# EAGLE design logic (EAGLE 7.1.0)
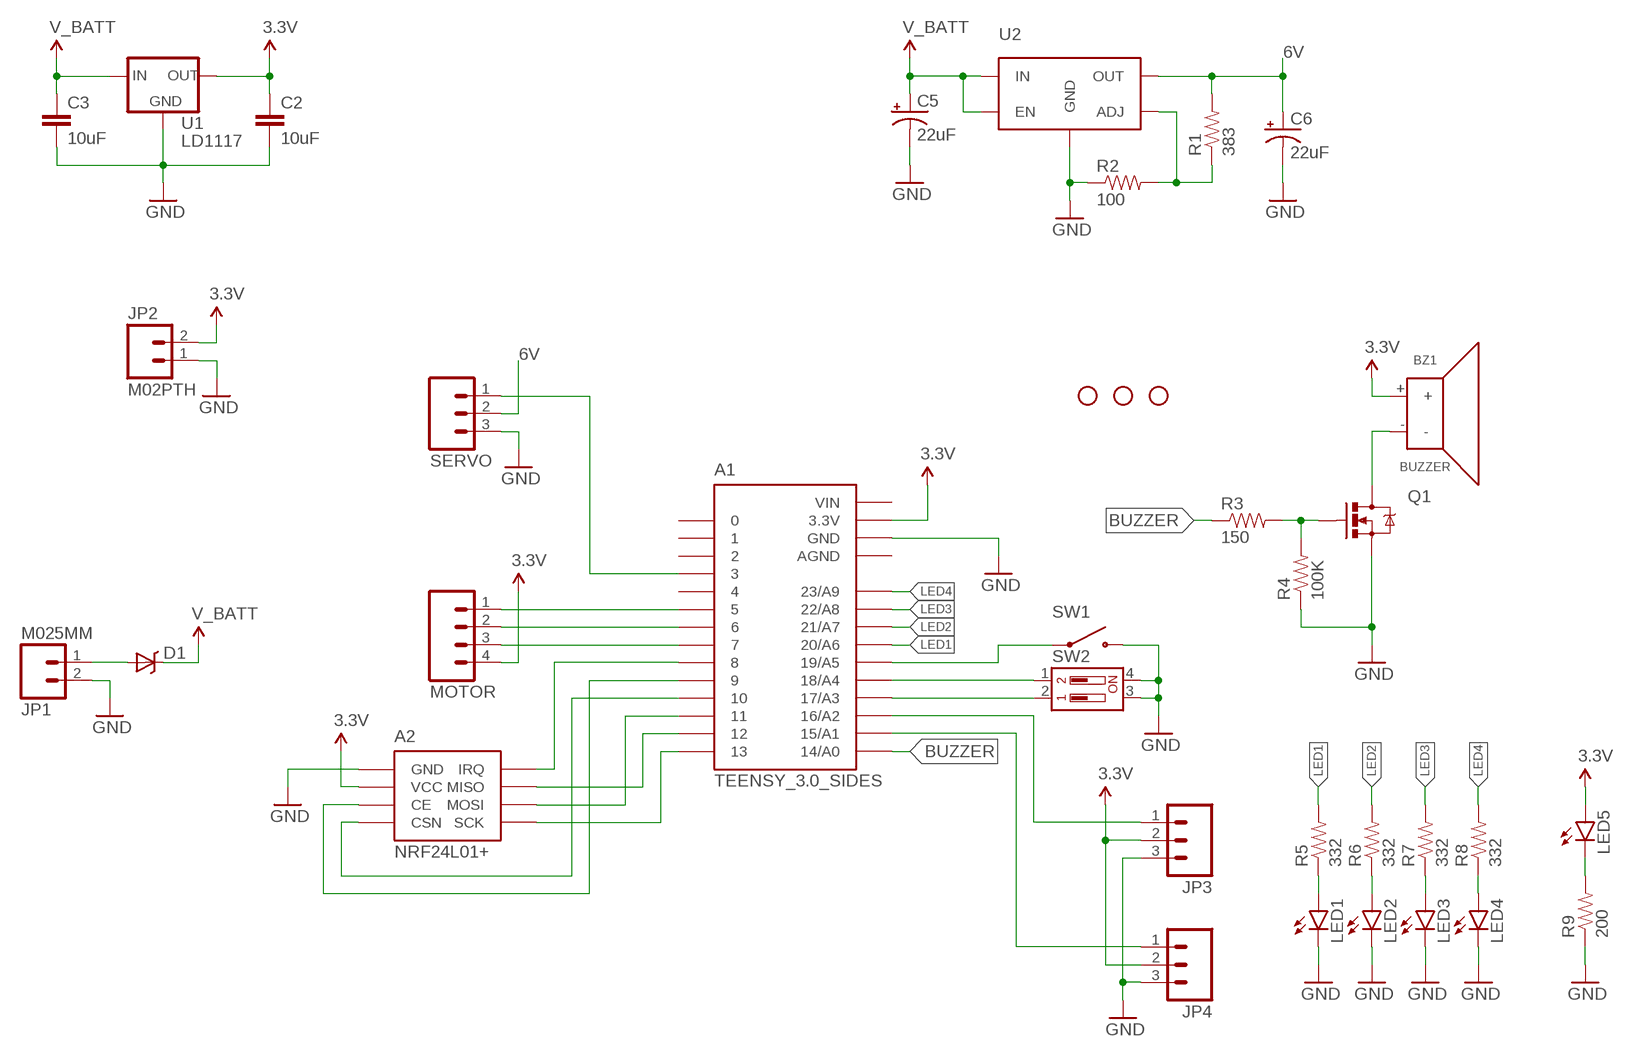
[diagram p0: schematic, sheet 1]

## Parts
A1  TEENSY_3.0_SIDES  [TEENSY_3.0_SIDES]
A2  NRF24L01+  [NRF24L01+]
BZ1  BUZZER  [BUZZER]
C2  10uF  CAP1206  [1206]
C3  10uF  CAP1206  [1206]
C5  22uF  CAP_POLPTH2  [CPOL-RADIAL-10UF-25V]
C6  22uF  CAP_POLPTH2  [CPOL-RADIAL-10UF-25V]
D1  DIODE-SCHOTTKY_  [SMA-DIODE]
JP1  M025MM  [SCREWTERMINAL-5MM-2]
JP2  M02PTH  [1X02]
JP3  M03LOCK  [1X03_LOCK]
JP4  M03LOCK  [1X03_LOCK]
LED1  LED0603  [LED-0603]
LED2  LED0603  [LED-0603]
LED3  LED0603  [LED-0603]
LED4  LED0603  [LED-0603]
LED5  LED0603  [LED-0603]
MOTOR  M04LOCK  [1X04_LOCK]
Q1  MOSFET-NCHANNELBSS123LT1G  [SOT23-3]
R1  383  RESISTOR0603-RES  [0603-RES]
R2  100  RESISTOR0603-RES  [0603-RES]
R3  150  RESISTOR0603-RES  [0603-RES]
R4  100K  RESISTOR0603-RES  [0603-RES]
R5  332  RESISTOR0603-RES  [0603-RES]
R6  332  RESISTOR0603-RES  [0603-RES]
R7  332  RESISTOR0603-RES  [0603-RES]
R8  332  RESISTOR0603-RES  [0603-RES]
R9  200  RESISTOR0603-RES  [0603-RES]
SERVO  M03LOCK_LONGPADS  [1X03_LOCK_LONGPADS]
STANDOFF1  STAND-OFF  [STAND-OFF]
STANDOFF2  STAND-OFF  [STAND-OFF]
STANDOFF3  STAND-OFF  [STAND-OFF]
SW1  FSM4JSMA  [FSM4JSMA]
SW2  2-POS-DIPCTS-THRU-HOLE  [209-2LPST]
U1  LD1117  [SOT-223]
U2  MIC29302AWD  [TO-252-5]

## Nets
3.3V: A1.3.3V A2.2(VCC) BZ1.+ C2.1 JP2.2 JP3.2 JP4.2 LED5.A MOTOR.4 U1.2(OUT) U1.4(OUT)
6V: C6.1(+) R1.2 SERVO.2 U2.P$4(OUT)
BUZZER: A1.14/A0 R3.1
GND: A1.GND A2.1(GND) C2.2 C3.2 C5.2(-) C6.2(-) JP1.2 JP2.1 JP3.3 JP4.3 LED1.C LED2.C LED3.C LED4.C Q1.2(S) R2.1 R4.1 R9.1 SERVO.3 SW1.3 SW1.4 SW2.3 SW2.4 U1.1(GND) U2.P$3(GND) U2.PAD(GND)
LED1: A1.20/A6 R5.2
LED2: A1.21/A7 R6.2
LED3: A1.22/A8 R7.2
LED4: A1.23/A9 R8.2
N$1: D1.A JP1.1
N$2: A1.16/A2 JP3.1
N$3: A1.15/A1 JP4.1
N$4: R1.1 R2.2 U2.P$5(ADJ)
N$5: A1.13 A2.5(SCK)
N$6: A1.12 A2.7(MISO)
N$7: A1.11 A2.6(MOSI)
N$8: A1.10 A2.4(CSN)
N$9: A1.8 A2.8(IRQ)
N$10: A1.9 A2.3(CE)
N$11: A1.3 SERVO.1
N$12: BZ1.- Q1.3(D)
N$13: Q1.1(G) R3.2 R4.2
N$14: LED4.A R8.1
N$15: A1.5 MOTOR.1
N$16: A1.6 MOTOR.2
N$17: A1.7 MOTOR.3
N$18: A1.19/A5 SW1.1 SW1.2
N$19: A1.18/A4 SW2.1
N$20: A1.17/A3 SW2.2
N$21: LED3.A R7.1
N$22: LED2.A R6.1
N$23: LED1.A R5.1
N$24: LED5.C R9.2
V_BATT: C3.1 C5.1(+) D1.C U1.3(IN) U2.P$1(EN) U2.P$2(IN)
Unconnected: A1.0 A1.1 A1.2 A1.4

## Power pins joined to a net without a drawn wire
AGND: A1.AGND
VIN: A1.VIN

## Library data of the parts
A1 = Teensy3.0:TEENSY_3.0_SIDES
A2 = Custom:NRF24L01+: 2.4 GHz Radio Module
BZ1 = Custom:BUZZER
C2 C3 = SparkFun-Passives:CAP: Capacitor Standard 0603 ceramic capacitor, and 0.1" leaded capacitor.
C5 C6 = SparkFun-Passives:CAP_POL: Capacitor Polarized These are standard SMD and PTH capacitors. Normally 10uF, 47uF, and 100uF in electrolytic and tantalum varieties. Always verify the external diameter of the through hole cap, it varies with capacity, voltage, and manufacturer. The EIA devices should be standard.
D1 = SparkFun-DiscreteSemi:DIODE-SCHOTTKY: Commonly MBRA140.
JP1 JP2 = SparkFun-Connectors:M02: Standard 2-pin 0.1" header. Use with - straight break away headers ( PRT-00116) - right angle break away headers (PRT-00553) - swiss pins (PRT-00743) - machine pins (PRT-00117) - female headers (PRT-00115) Molex polarized connector foot print use with: PRT-08233 with associated crimp pins and housings. 2.54_SCREWTERM for use with PRT-10571. 3.5mm Screw Terminal footprints for PRT-08084 5mm Screw Terminal footprints for use with PRT-08433
JP3 JP4 SERVO = SparkFun-Connectors:M03: Header 3 Standard 3-pin 0.1" header. Use with straight break away headers (SKU : PRT-00116), right angle break away headers (PRT-00553), swiss pins (PRT-00743), machine pins (PRT-00117), and female headers (PRT-00115). Molex polarized connector foot print use with SKU : PRT-08232 with associated crimp pins and housings.
LED1-LED5 = SparkFun-LED:LED: LEDs Standard schematic elements and footprints for 5mm, 3mm, 1206, and 0603 sized LEDs. 5mm - Spark Fun Electronics SKU : COM-00529 (and others)
MOTOR = SparkFun-Connectors:M04: Header 4 Standard 4-pin 0.1" header. Use with straight break away headers (SKU : PRT-00116), right angle break away headers (PRT-00553), swiss pins (PRT-00743), machine pins (PRT-00117), and female headers (PRT-00115). Molex polarized connector foot print use with SKU : PRT-08231 with associated crimp pins and housings. 1MM SMD Version SKU: PRT-10208
Q1 = SparkFun-DiscreteSemi:MOSFET-NCHANNEL: Common NMOSFET Parts MFG P/N Store ID Prod ID FDD8780 TRANS-09984 SI7820DN TRANS-11055 FDS6630A IC-08089 2N7002PW TRANS-11151 FQP30N06L COM-10213 TRANS-10060 BSS123LT1G TRANS-08345 BSS138 TRANS-00830 BS170 2N7000; PROD_ID: TRANS-08345
R1-R9 = SparkFun-Passives:RESISTOR: Resistor Basic schematic elements and footprints for 0603, 1206, and PTH resistors.
STANDOFF1-STANDOFF3 = SparkFun-Electromechanical:STAND-OFF: #4 Stand Off This is the mechanical footprint for a #4 phillips button head screw. Use the keepout ring to avoid running the screw head into surrounding components. SKU : PRT-00447
SW1 = Custom:FSM4JSMA
SW2 = SparkFun-Electromechanical:2-POS-DIP: SMD dip switch 2 positions; PROD_ID: SWCH-12532
U1 = Custom:LD1117: Low-Dropout Voltage Regulator
U2 = Custom:MIC29302AWD

## Board
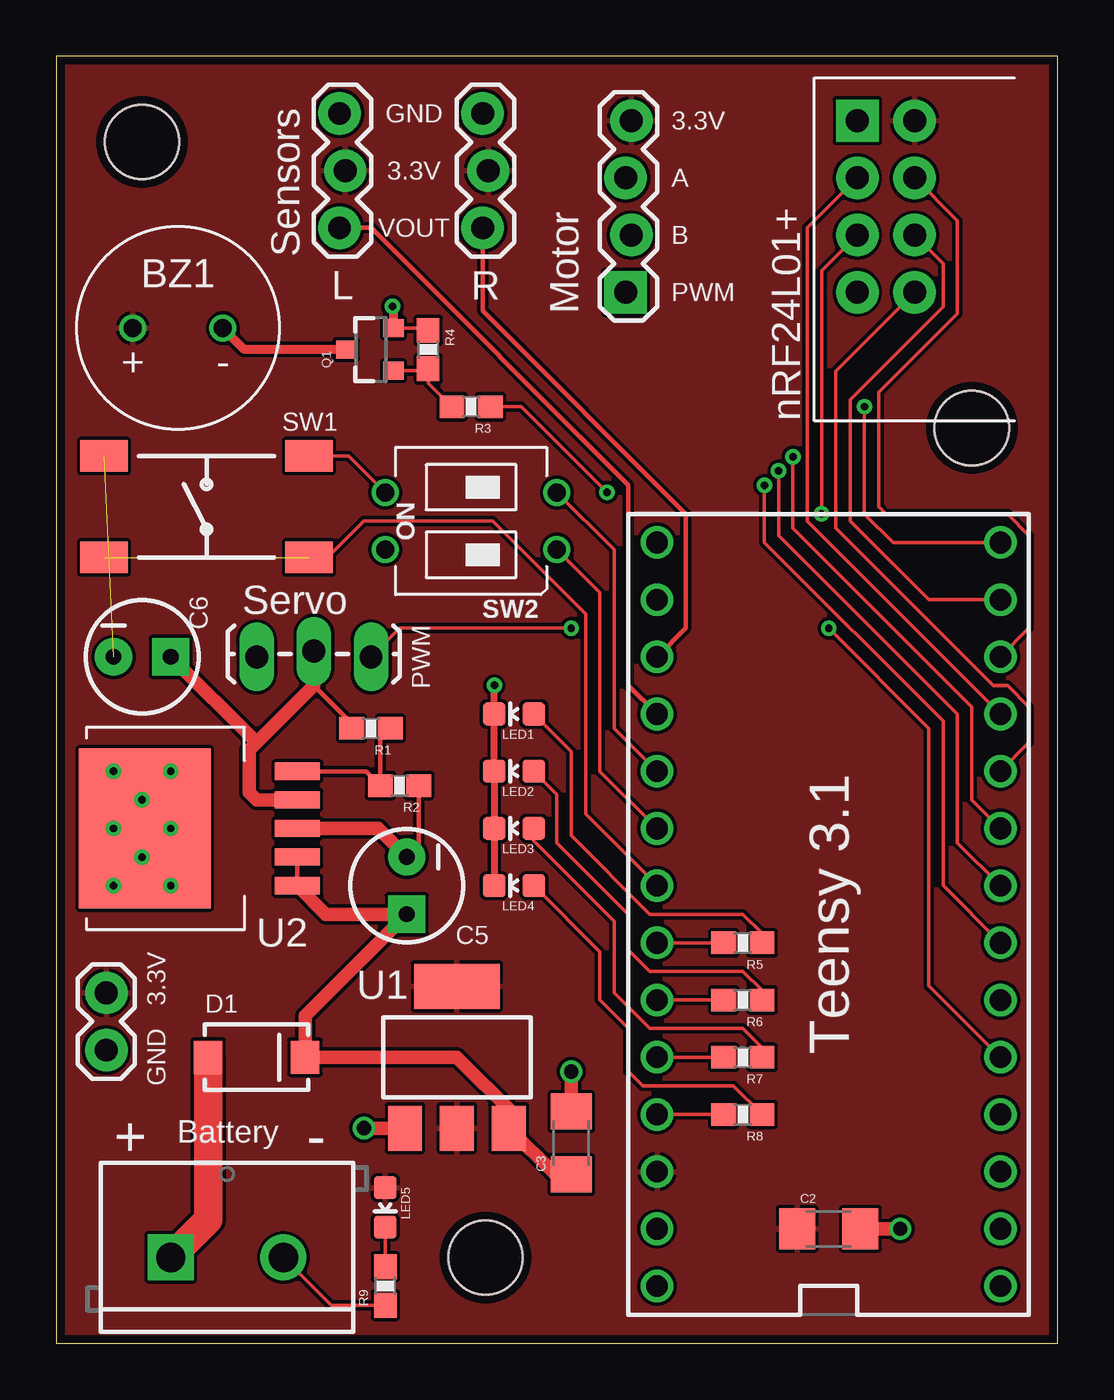
[diagram p1: board, top side]
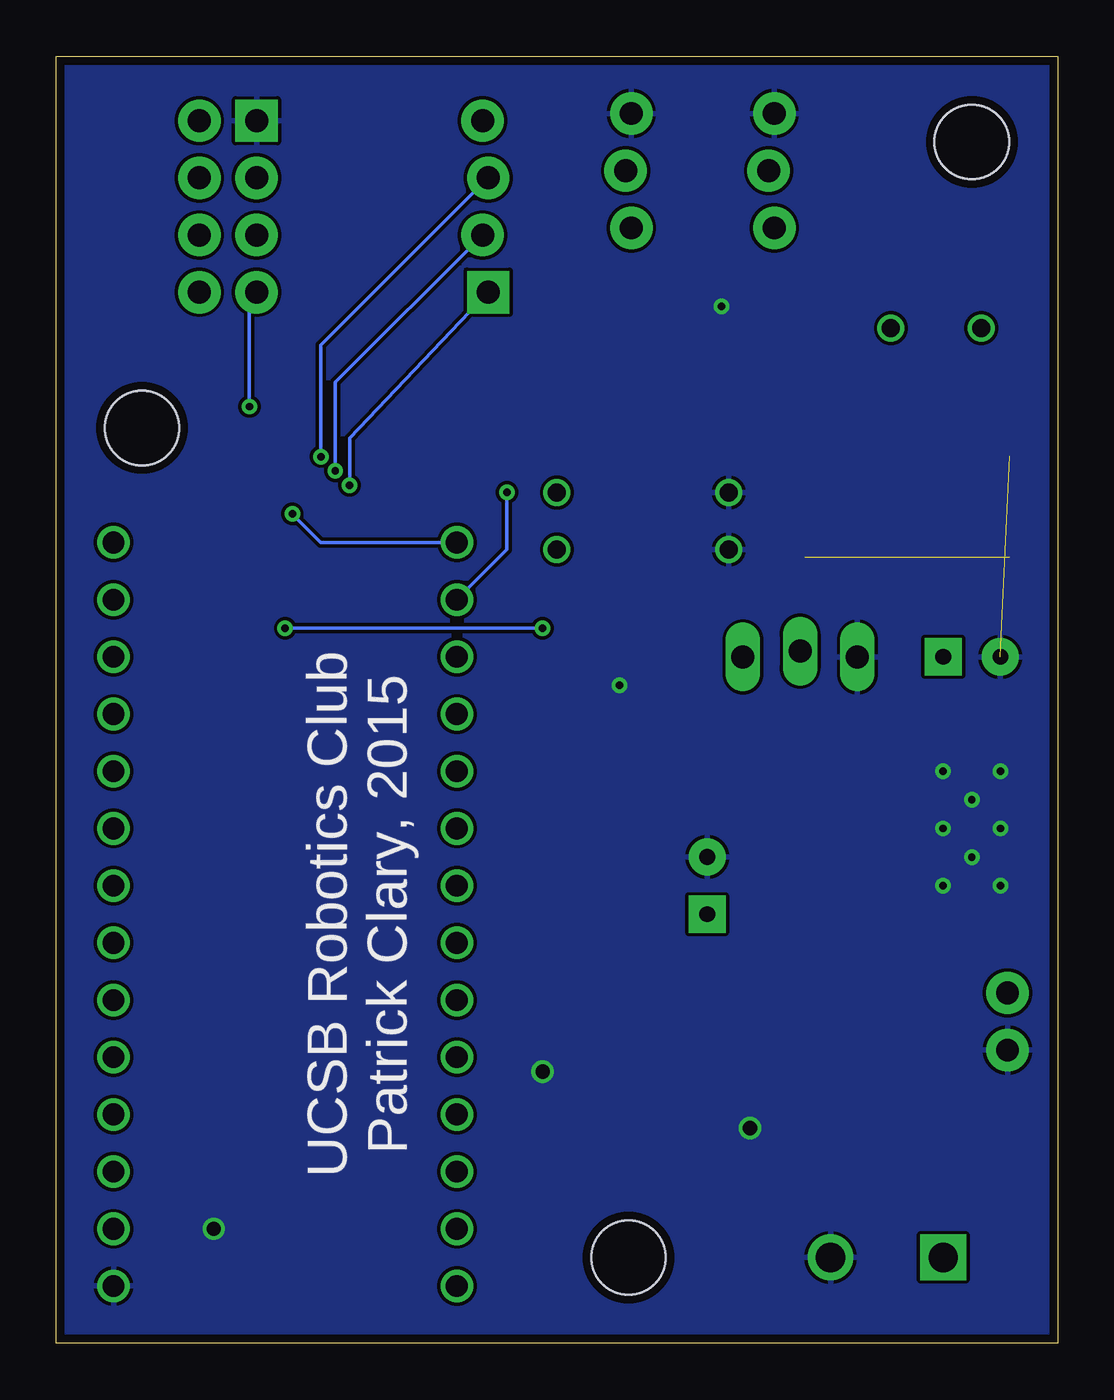
[diagram p2: board, bottom side, seen from below]

Size 44.45 x 57.15 mm. Coordinates in mm from the lower left corner, seen from the top.
Outline: 0,0 44.45,0 44.45,57.15 0,57.15 0,0
Copper layers (1*16): Top 0.0356mm / dielectric 1.5011mm / Bottom 0.0356mm
Design rules "LaenPCBOrder *": minimum track width 6mil, minimum drill 13mil, track to track 6mil, track to pad 6mil, pad to pad 6mil, via to via 6mil, smd to smd 6mil, copper to edge 15mil, drill to drill 6mil, minimum pad ring 7mil, minimum via ring 7mil, stop-mask expansion 3mil, vias tented up to drill 0mil, thermal gap 6mil

### Footprints (pad centres in the part's own frame; a part is rotated, then mirrored left to right if it is on the bottom)
TEENSY_3.0_SIDES = drill 0.965: 0 -7.62,13.97; 1 -7.62,11.43; 2 -7.62,8.89; 3 -7.62,6.35; 3.3V 7.62,11.43; 4 -7.62,3.81; 5 -7.62,1.27; 6 -7.62,-1.27; 7 -7.62,-3.81; 8 -7.62,-6.35; 9 -7.62,-8.89; 10 -7.62,-11.43; 11 -7.62,-13.97; 12 -7.62,-16.51; 13 7.62,-16.51; 14/A0 7.62,-13.97; 15/A1 7.62,-11.43; 16/A2 7.62,-8.89; 17/A3 7.62,-6.35; 18/A4 7.62,-3.81; 19/A5 7.62,-1.27; 20/A6 7.62,1.27; 21/A7 7.62,3.81; 22/A8 7.62,6.35; 23/A9 7.62,8.89; AGND 7.62,13.97; GND -7.62,16.51; VIN 7.62,16.51
NRF24L01+ = drill 1.016 pad 1.88 square: 1 -3.81,-1.27 | drill 1.016 pad 1.88: 2 -3.81,1.27; 3 -1.27,-1.27; 4 -1.27,1.27; 5 1.27,-1.27; 6 1.27,1.27; 7 3.81,-1.27; 8 3.81,1.27
BUZZER = drill 0.8: + 2,0; - -2,0
1206 = smd 1.6 x 1.8: 1 -1.4,0; 2 1.4,0
CPOL-RADIAL-10UF-25V = drill 0.7 pad 1.651 square: 1 1.27,0 | drill 0.7 pad 1.651: 2 -1.27,0
SMA-DIODE = smd 1.27 x 1.47: A -2.15,0; C 2.15,0
SCREWTERMINAL-5MM-2 = drill 1.3 pad 2.032 square: 1 0,0 | drill 1.3 pad 2.032: 2 5,0
1X02 = drill 1.016 pad 1.88: 1 0,0; 2 2.54,0
1X03_LOCK = drill 1.016 pad 1.88: 1 0,0.127; 2 2.54,-0.127; 3 5.08,0.127
LED-0603 = smd 1 x 1: A 0,-0.877; C 0,0.877
1X04_LOCK = drill 1.016 pad 1.88 square: 1 0,0.127 | drill 1.016 pad 1.88: 2 2.54,-0.127; 3 5.08,0.127; 4 7.62,-0.127
SOT23-3 = smd 0.8 x 0.9: 1 -0.95,-1; 2 0.95,-1; 3 0,1.1
0603-RES = smd 1.1 x 1: 1 -0.85,0; 2 0.85,0
1X03_LOCK_LONGPADS = drill 1.016 long: 1 0,0; 2 2.54,-0.254; 3 5.08,0
STAND-OFF = hole 3.302: 0,0
FSM4JSMA = smd 1.4 x 2.1: 1 -2.25,4.55; 2 -2.25,-4.55; 3 2.25,4.55; 4 2.25,-4.55
209-2LPST = drill 0.8: 1 -1.27,-3.81; 2 1.27,-3.81; 3 1.27,3.81; 4 -1.27,3.81
SOT-223 = smd 1.5 x 2: 1 -2.3,-3.15; 2 0,-3.15; 3 2.3,-3.15 | smd 3.8 x 2: 4 0,3.15
TO-252-5 = smd 0.76 x 2: P$1 -2.54,-4.35; P$2 -1.27,-4.35; P$3 0,-4.35; P$4 1.27,-4.35; P$5 2.54,-4.35 | smd 7.1 x 5.85: PAD 0,2.425

### Placement (x,y rotation side)
A1  34.29,19.05 180 top
A2  36.83,50.48 270 top
BZ1  5.4,45.09 180 top
C2  34.29,5.08 0 top
C3  22.86,8.89 90 top
C5  15.56,20.32 270 top
C6  3.81,30.48 0 top
D1  8.89,12.7 0 top
JP1  5.08,3.81 0 top
JP2  2.22,13.02 90 top
JP3  12.7,49.53 90 top
JP4  19.05,49.53 90 top
LED1  20.32,27.94 90 top
LED2  20.32,25.4 90 top
LED3  20.32,22.86 90 top
LED4  20.32,20.32 90 top
LED5  14.61,6.03 180 top
MOTOR  25.4,46.67 90 top
Q1  13.97,44.13 90 top
R1  13.97,27.3 180 top
R2  15.24,24.77 180 top
R3  18.41,41.59 180 top
R4  16.51,44.13 270 top
R5  30.48,17.78 180 top
R6  30.48,15.24 180 top
R7  30.48,12.7 180 top
R8  30.48,10.16 180 top
R9  14.61,2.54 90 top
SERVO  13.97,30.48 180 top
STANDOFF1  3.81,53.34 0 top
STANDOFF2  19.05,3.81 0 top
STANDOFF3  40.64,40.64 0 top
SW1  6.67,37.15 90 top
SW2  18.41,36.51 90 top
U1  17.78,12.7 0 top
U2  6.35,22.86 90 top

### Tracks (layer width: path | path; a pad name or v marks a point on that pad's centre or on a via)
3.3V
  pour Top: 0,0 44.45,0 44.45,57.15 0,57.15
6V
  Top 0.203: R1.2 13.12,27.52 11.43,29.21
  Top 0.61: U2.P$4 8.89,24.13 8.57,24.45 8.57,26.35 8.89,26.67 | 8.89,26.67 11.43,29.21 SERVO.2 | C6.1 8.89,26.67
BUZZER  (via drill 0.33)
  Top 0.152: v24.45,37.78 20.64,41.59 R3.1
  Bottom 0.152: A1.14/A0 24.45,35.24 v24.45,37.78
GND  (via drill 0.33, 0.64)  (1 unrouted)
  Top 0.152: Q1.2 16.41,45.08 R4.1 | SW1.4 12.99,39.4 SW2.3 | R9.1 12.2,1.69 JP1.2
  Top 0.203: R2.1 16.09,22.12 C5.2
  Top 0.305: LED4.C LED3.C LED2.C LED1.C v19.44,29.21
  Top 0.406: Q1.2 14.97,45.99 v14.92,46.04
  Top 0.61: U1.1 v13.65,9.55 | 3.81,22.86 U2.PAD v5.08,22.86 | C5.2 14.29,22.86 U2.P$3 | C2.2 v37.47,5.08 | C3.2 v22.86,12.06
  other vias: 2.54,25.4 5.08,25.4 3.81,24.13 2.54,22.86 3.81,21.59 5.08,20.32 2.54,20.32
  pour Bottom: 0,0 44.45,0 44.45,57.15 0,57.15
LED1
  Top 0.152: A1.20/A6 R5.2
LED2
  Top 0.152: A1.21/A7 R6.2
LED3
  Top 0.152: A1.22/A8 R7.2
LED4
  Top 0.152: A1.23/A9 R8.2
N$1
  Top 1.27: JP1.1 6.74,5.47 D1.A
N$2
  Top 0.203: A1.16/A2 25.4,29.21 25.4,38.1 13.97,49.53 JP3.1
N$3
  Top 0.203: A1.15/A1 27.94,31.75 27.94,36.83 18.92,45.85 JP4.1
N$4
  Top 0.203: R1.1 14.39,26.88 R2.2 13.76,25.4 U2.P$5
N$5  (via drill 0.33)
  Top 0.152: v33.97,36.83 33.97,47.62 A2.5
  Bottom 0.152: A1.13 32.7,35.56 v33.97,36.83
N$6  (via drill 0.33)
  Top 0.152: A1.12 37.15,35.56 35.88,36.83 v35.88,41.59
  Bottom 0.152: v35.88,41.59 35.88,46.35 A2.7
N$7
  Top 0.152: A1.11 38.73,33.02 35.24,36.51 35.24,41.91 39.37,46.04 39.37,47.94 A2.6
N$8
  Top 0.152: A2.4 40.01,49.85 40.01,45.72 36.51,42.23 36.51,37.15 36.83,36.83 42.23,36.83 43.18,35.88 43.18,31.75 A1.10
N$9
  Top 0.152: A2.8 34.61,43.18 34.61,36.2 41.59,29.21 42.23,29.21 43.18,28.26 43.18,26.67 A1.8
N$10
  Top 0.152: A1.9 33.34,36.51 33.34,49.53 A2.3
N$11  (via drill 0.33)
  Top 0.152: A1.3 38.73,15.88 38.73,27.3 v34.29,31.75 | v22.86,31.75 15.24,31.75 SERVO.1
  Bottom 0.152: v34.29,31.75 v22.86,31.75
N$12
  Top 0.406: Q1.3 8.35,44.13 BZ1.-
N$13
  Top 0.152: Q1.1 16.41,43.18 R4.2 16.51,42.65 R3.2
N$14
  Top 0.152: R8.1 30.06,11.43 26.04,11.43 25.4,12.06 25.4,13.97 24.13,15.24 24.13,17.39 LED4.A
N$15  (via drill 0.33)
  Top 0.152: A1.5 39.37,20.32 39.37,27.62 31.43,35.56 v31.43,38.1
  Bottom 0.152: MOTOR.1 31.43,40.2 v31.43,38.1
N$16  (via drill 0.33)
  Top 0.152: A1.6 40.01,22.23 40.01,27.94 32.07,35.88 v32.07,38.73
  Bottom 0.152: MOTOR.2 32.07,42.67 v32.07,38.73
N$17  (via drill 0.33)
  Top 0.152: A1.7 40.64,24.13 40.64,28.26 32.7,36.2 v32.7,39.37
  Bottom 0.152: MOTOR.3 32.7,44.32 v32.7,39.37
N$18  (1 unrouted)
  Top 0.152: SW1.2 12.04,34.9 13.65,36.51 19.37,36.51 23.5,32.38 23.5,23.5 A1.19/A5
N$19
  Top 0.152: A1.18/A4 24.13,25.4 24.13,33.34 SW2.1
N$20
  Top 0.152: A1.17/A3 24.77,27.3 24.77,35.24 SW2.2
N$21
  Top 0.152: R7.1 31.33,13.12 30.48,13.97 26.35,13.97 24.77,15.56 24.77,18.73 21.2,22.3 LED3.A
N$22
  Top 0.152: R6.1 31.33,15.66 30.48,16.51 26.35,16.51 25.4,17.46 25.4,19.05 22.23,22.23 22.23,24.37 LED2.A
N$23
  Top 0.152: R5.1 31.33,18.2 30.48,19.05 26.35,19.05 22.86,22.54 22.86,26.28 LED1.A
N$24
  Top 0.152: LED5.C R9.2
V_BATT
  Top 0.203: U2.P$1 U2.P$2
  Top 0.61: 20.32,10.16 17.78,12.7 D1.C 11.04,14.53 C5.1 11.97,19.05 U2.P$1 | 20.32,10.16 20.32,9.79 U1.3 22.14,7.49 C3.1 | 20.45,10.03 20.32,10.16

### Text on the board
tPlace: GND | 3.3V | 3.3V | A | VOUT | B | Sensors | L | R | PWM | Motor | nRF24L01+ | Servo | PWM | Teensy 3.1 | 3.3V | GND | + | Battery | -
bPlace: UCSB Robotics Club / Patrick Clary, 2015